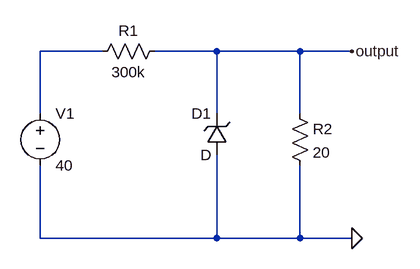
[diagram p0: schematic zener_regulator.asc]
zener_regulator.asc, the LTspice schematic file:
Version 4
SHEET 1 880 680
WIRE 256 192 160 192
WIRE 432 192 336 192
WIRE 560 192 432 192
WIRE 640 192 560 192
WIRE 160 288 160 192
WIRE 432 288 432 192
WIRE 560 288 560 192
WIRE 160 480 160 368
WIRE 432 480 432 352
WIRE 432 480 160 480
WIRE 560 480 560 368
WIRE 560 480 432 480
WIRE 640 480 560 480
FLAG 640 192 output
FLAG 640 480 0
SYMBOL voltage 160 272 R0
SYMATTR InstName V1
SYMATTR Value 40
SYMBOL res 352 176 R90
WINDOW 0 0 56 VBottom 2
WINDOW 3 32 56 VTop 2
SYMATTR InstName R1
SYMATTR Value 300k
SYMBOL zener 448 352 R180
WINDOW 0 24 64 Left 2
WINDOW 3 24 0 Left 2
SYMATTR InstName D1
SYMBOL res 544 272 R0
SYMATTR InstName R2
SYMATTR Value 20

The netlist it stands for:
* zener_regulator.asc
V1 N001 0 40
R1 output N001 300k
D1 0 output D
R2 output 0 20
.model D D
.lib standard.dio
.backanno
.end